# EAGLE design femto-beacon-esp32pico-d4-coin (EAGLE 9.3.0)

## Sheet 1 of 2
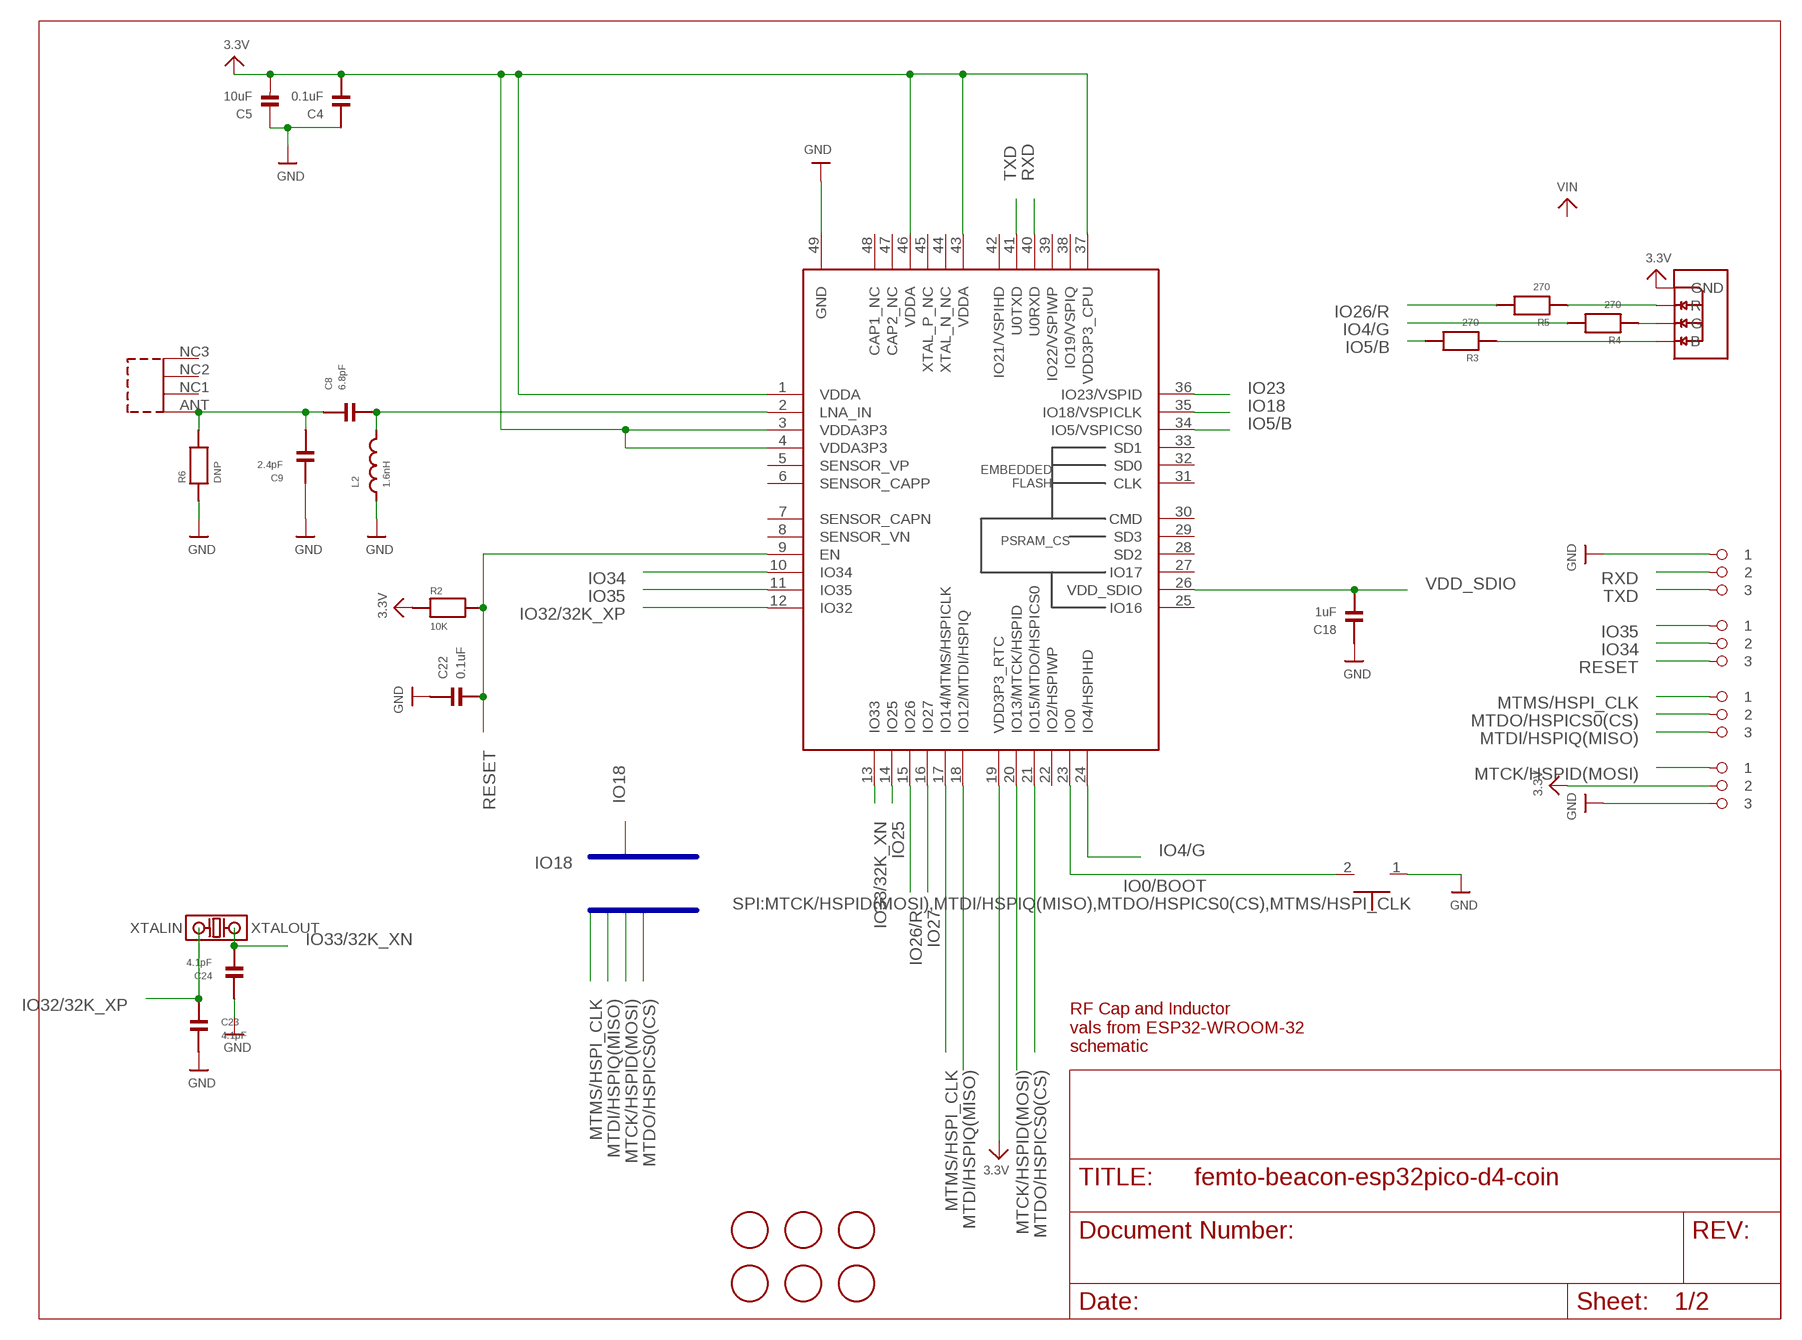
[diagram p0: schematic, sheet 1]

### Parts
ANT1  0479480001  [0479480001]
BOOT1  TACTILE_SWITCH_NO_GND_NO_BOSS  [SIDE_ACT_NO_GND_NO_BOSS]
C4  0.1uF  CAPACITOR_0201  [PART]
C5  10uF  CAP_CERAMIC_0603MP  [_0603MP]
C8  6.8pF  CAPACITOR_0201  [PART]
C9  2.4pF  CAPACITOR_0201  [PART]
C18  1uF  CAPACITOR_0201  [PART]
C22  0.1uF  CAPACITOR_0201  [PART]
C23  4.1pF  CAPACITOR_0201  [PART]
C24  4.1pF  CAPACITOR_0201  [PART]
FID1  FIDUCIAL  [FIDUCIAL_1MM]
FID2  FIDUCIAL  [FIDUCIAL_1MM]
FID3  FIDUCIAL  [FIDUCIAL_1MM]
FID4  FIDUCIAL  [FIDUCIAL_1MM]
FID5  FIDUCIAL  [FIDUCIAL_1MM]
FID6  FIDUCIAL  [FIDUCIAL_1MM]
IC1  ESP32-PICO-D4  [ESP32-QFN48_7X7]
L2  1.6nH  INDUCTOR_FIXED_0201  [PART]
PIN_EN  1X3_ROUND  [1X3_ROUND]
PIN_GPIO_A  1X3_ROUND  [1X3_ROUND]
PIN_GPIO_B  1X3_ROUND  [1X3_ROUND]
PIN_UART  1X3_ROUND  [1X3_ROUND]
R2  10K  RESISTOR_0201  [PART]
R3  270  RESISTOR_0201  [PART]
R4  270  RESISTOR_0201  [PART]
R5  270  RESISTOR_0201  [PART]
R6  DNP  RESISTOR_0201  [PART]
RGB1  LRTB_R48G  [LRTB_R48G]
XTAL2  ABS06-107-32.768KHZ-T  [ABS06-107-32.768KHZ-T]

### Nets
3.3V: C4.2 C5.2 IC1.1(VDDA) IC1.3(VDDA3P3) IC1.4(VDDA3P3) IC1.19(VDD3P3_RTC) IC1.37(VDD3P3_CPU) IC1.43(VDDA) IC1.46(VDDA) PIN_GPIO_A.P$2 R2.1 RGB1.1(GND) ; also sheet 2
ANT: C8.2 IC1.2(LNA_IN) L2.2
B_: R3.1 RGB1.4(B)
G_: R4.1 RGB1.3(G)
GND: BOOT1.1 C4.1 C5.1 C9.1 C18.1 C22.1 C23.1 C24.2 IC1.49(GND) L2.1 PIN_GPIO_A.P$3 PIN_UART.P$1 R6.1 ; also sheet 2
IO0/BOOT: BOOT1.2 IC1.23(IO0)
IO4/G: IC1.24(IO4/HSPIHD) R4.2
IO5/B: IC1.34(IO5/VSPICS0) R3.2
IO18: IC1.35(IO18/VSPICLK)
IO23: IC1.36(IO23/VSPID)
IO25: IC1.14(IO25)
IO26/R: IC1.15(IO26) R5.2
IO27: IC1.16(IO27)
IO32/32K_XP: C23.2 IC1.12(IO32) XTAL2.1(XTALIN)
IO33/32K_XN: C24.1 IC1.13(IO33) XTAL2.2(XTALOUT)
IO34: IC1.10(IO34) PIN_EN.P$2
IO35: IC1.11(IO35) PIN_EN.P$1
MTCK/HSPID(MOSI): IC1.20(IO13/MTCK/HSPID) PIN_GPIO_A.P$1
MTDI/HSPIQ(MISO): IC1.18(IO12/MTDI/HSPIQ) PIN_GPIO_B.P$3
MTDO/HSPICS0(CS): IC1.21(IO15/MTDO/HSPICS0) PIN_GPIO_B.P$2
MTMS/HSPI_CLK: IC1.17(IO14/MTMS/HSPICLK) PIN_GPIO_B.P$1
N$6: ANT1.ANT C8.1 C9.2 R6.2
R_: R5.1 RGB1.2(R)
RESET: C22.2 IC1.9(EN) PIN_EN.P$3 R2.2
RXD: IC1.40(U0RXD) PIN_UART.P$2
TXD: IC1.41(U0TXD) PIN_UART.P$3
VDD_SDIO: C18.2 IC1.26(VDD_SDIO)
Unconnected: ANT1.NC1 ANT1.NC2 ANT1.NC3 IC1.5(SENSOR_VP) IC1.6(SENSOR_CAPP) IC1.7(SENSOR_CAPN) IC1.8(SENSOR_VN) IC1.22(IO2/HSPIWP) IC1.25(IO16) IC1.27(IO17) IC1.28(SD2) IC1.29(SD3) IC1.30(CMD) IC1.31(CLK) IC1.32(SD0) IC1.33(SD1) IC1.38(IO19/VSPIQ) IC1.39(IO22/VSPIWP) IC1.42(IO21/VSPIHD) IC1.44(XTAL_N_NC) IC1.45(XTAL_P_NC) IC1.47(CAP2_NC) IC1.48(CAP1_NC)

### Buses
SPI:MTCK/HSPID(MOSI),MTDI/HSPIQ(MISO),MTDO/HSPICS0(CS),MTMS/HSPI_CLK
IO18

### Notes on the sheet
- RF Cap and Inductor
  vals from ESP32-WROOM-32
  schematic

## Sheet 2 of 2
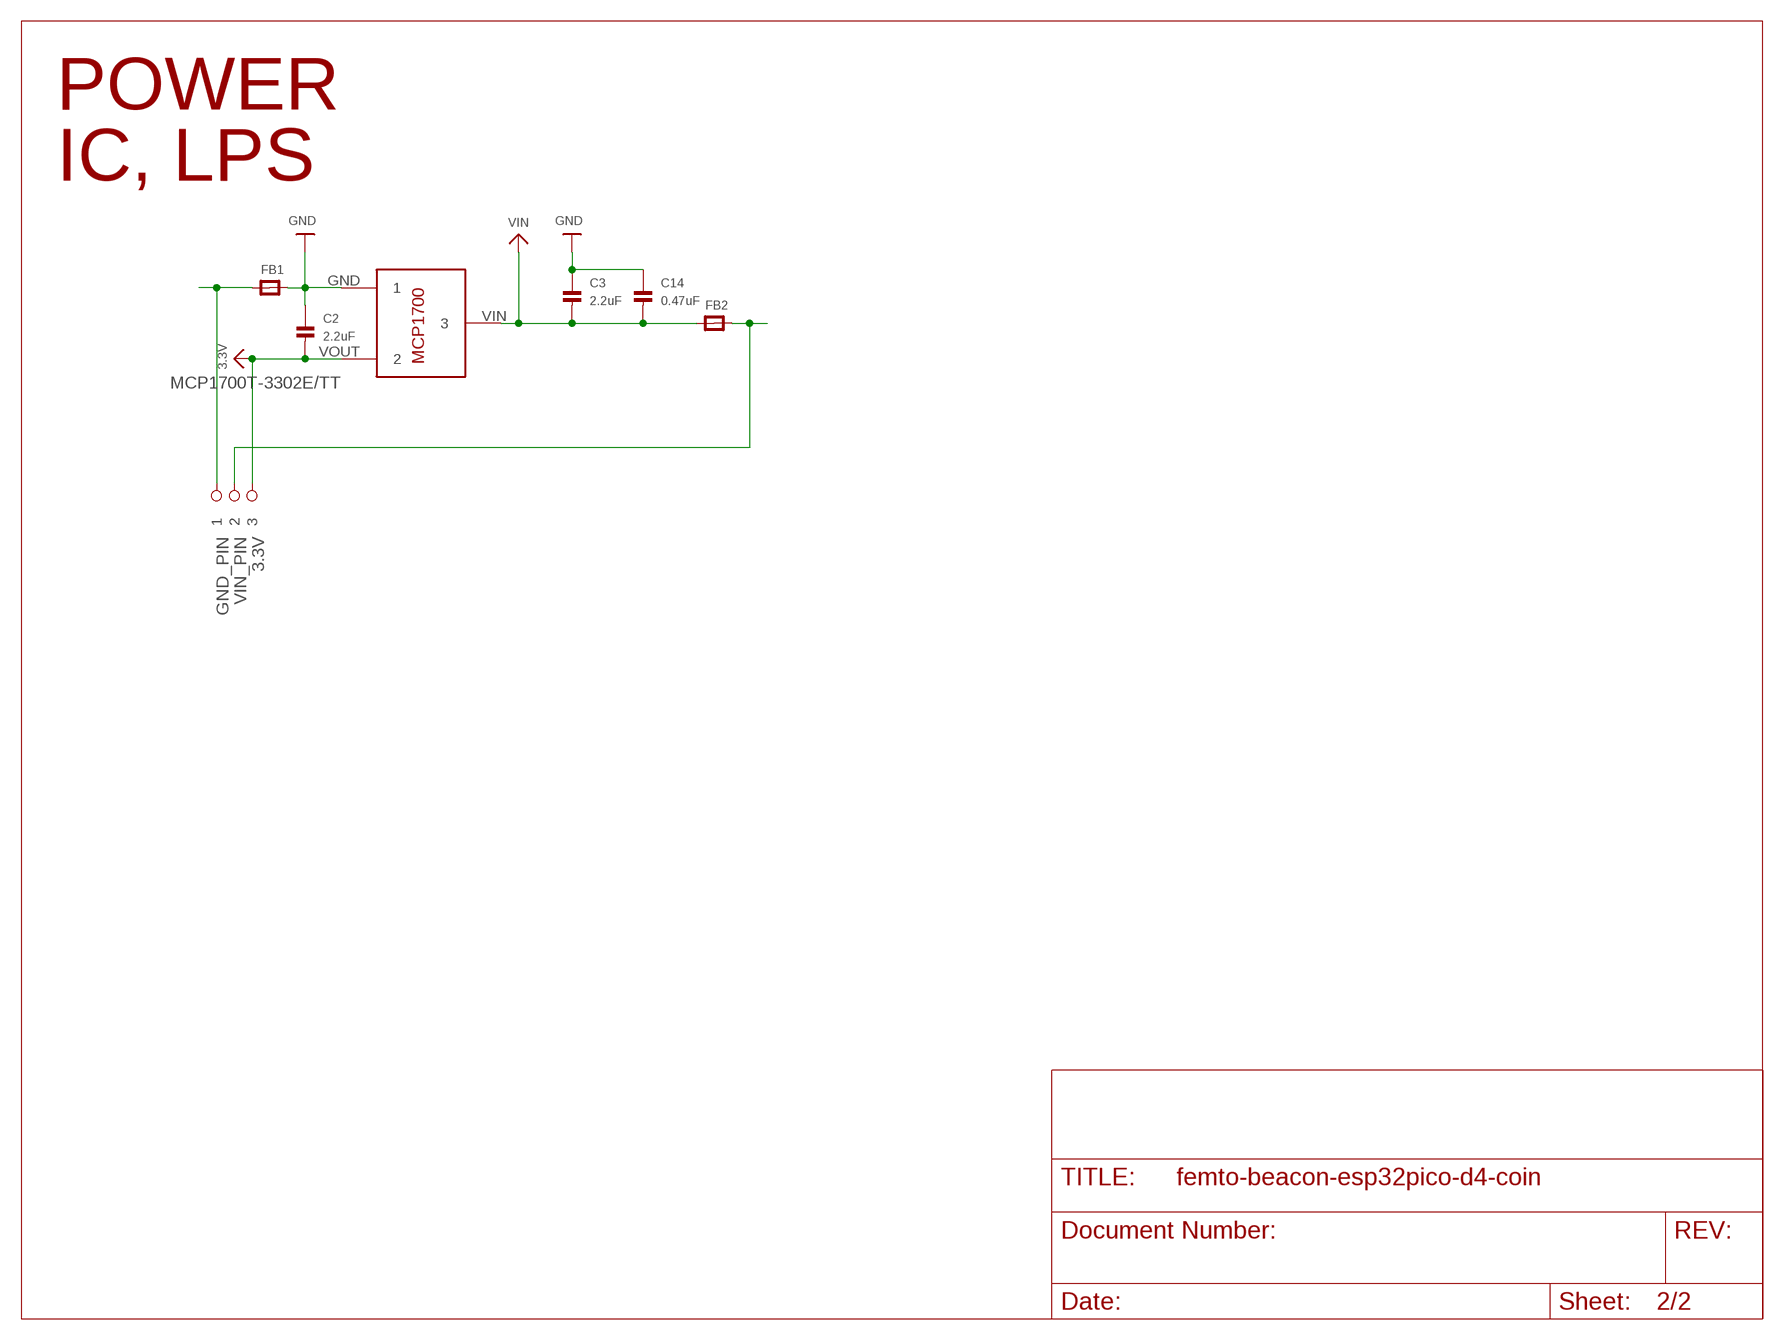
[diagram p1: schematic, sheet 2]

### Parts
C2  2.2uF  CAP_CERAMIC_0402MP  [_0402MP]
C3  2.2uF  CAP_CERAMIC_0402MP  [_0402MP]
C14  0.47uF  CAP_CERAMIC_0402MP  [_0402MP]
FB1  FERRITE_0603MP  [_0603MP]
FB2  FERRITE_0603MP  [_0603MP]
LDO1  MCP1700T-3302E/TT  [MCP1700T-3302E/TT]
PIN_PWR  1X3_ROUND  [1X3_ROUND]

### Nets
3.3V: C2.2 LDO1.VOUT PIN_PWR.P$3 ; also sheet 1
GND: C2.1 C3.1 C14.1 FB1.2 LDO1.GND ; also sheet 1
GND_PIN: FB1.1 PIN_PWR.P$1
VIN: C3.2 C14.2 FB2.1 LDO1.VIN
VIN_PIN: FB2.2 PIN_PWR.P$2

### Notes on the sheet
- POWER
- IC, LPS

## Library data of the parts
ANT1 = molex-antenna-2.4GHz:0479480001: Molex 2.4GHz SMD tower antenna.; MPN: 0479480001
BOOT1 = omron_tactile_switch:TACTILE_SWITCH_NO_GND_NO_BOSS: Omron tactile switch; MPN: B3U-3000P
C2 C3 = microbuilder:CAP_CERAMIC: Ceramic Capacitors 0402 - 0402 Surface Mount Capacitors 16pF 50V 5% [Digikey: 445-4899-2-ND] 18pF 50V 5% [Digikey: 490-1281-2-ND] 22pF 50V 5% [Digikey: 490-1283-2-ND] 68pF 50V 5% [Digikey: 490-1289-2-ND] 0.1uF 10V 10% [Digikey: 490-1318-2-ND] 1.0uF 6.3V 10% [Digikey: 490-1320-2-ND] 0603 - 0603 Surface Mount Capacitors 16 pF 50V 5% [Digikey: 445-5051-2-ND] 22 pF 50V [Digikey: PCC220ACVTR-ND] 33 pF 50V 5% [Digikey: 490-1415-1-ND] 56pF 50V 5% [Digikey: 490-1421-1-ND] 220pF 50V 5% [Digikey: 445-1285-1-ND] 680 pF 50V 2200 pF 50V 5% C0G [Digikey: 445-1297-1-ND] 5600 pF 100V 5% X7R [Digikey: 478-3711-1-ND] 0.1 µF 25V 10% [Digikey: PCC2277TR-ND] 0.22 µF 16V 10% X7R [Digikey: 445-1318-1-ND] 1.0 µF 25V 10% [Digikey: 445-5146-2-ND] 0603 - RF Specific 3pF 250V +/-0.1pF RF [Digikey: 712-1347-1-ND] 18 pF 250V 5% [Digikey: 478-3505-1-ND or 712-1322-1-ND] 56 pF 250V 5% C0G RF [Digikey: 490-4867-1-ND] 68 pF 250V RF [Digikey: 490-4868-1-ND] 0805 - 0805 Surface Mount Capacitors 220 pF 250V 2% RF Ceramic Capacitor [Digikey: 712-1398-1-ND] 1000 pF 50V 2% NP0 Ceramic Capacitor [Digikey: 478-3760-1-ND] 0.1 µF 25V 10% Ceramic Capacitor [Digikey: PCC1828TR-ND] 1.0 µF 16V 10% Ceramic Capacitor[Digikey: 490-1691-2-ND] 10.0 µF 10V 10% Ceramic Capacitor[Digikey: 709-1228-1-ND] 10.0 uF 16V 10% Ceramic Capacitor [Digikey: 478-5165-2-ND] 47 uF 6.3V 20% Ceramic Capacitor [Digikey: 587-1779-1-ND or 399-5506-1-ND] 1206 - 1206 Surface Mount Capacitors 47uF 10V 20% Ceramic Capacitor [Digikey: 490-5528-1-ND or 399-5508-1-ND or 445-6010-1-ND] 100uF 6.3V -20%, +80% Y5V Ceramic Capacitor (Digikey: 490-4512-1-ND, Mouser: 81-GRM31CF50J107ZE1L); MPN: C1005X5R0J225K050BC
C4 C22 = parts_0201:CAPACITOR_0201; MPN: GRM033C80J104KE84D
C5 = microbuilder:CAP_CERAMIC: Ceramic Capacitors 0402 - 0402 Surface Mount Capacitors 16pF 50V 5% [Digikey: 445-4899-2-ND] 18pF 50V 5% [Digikey: 490-1281-2-ND] 22pF 50V 5% [Digikey: 490-1283-2-ND] 68pF 50V 5% [Digikey: 490-1289-2-ND] 0.1uF 10V 10% [Digikey: 490-1318-2-ND] 1.0uF 6.3V 10% [Digikey: 490-1320-2-ND] 0603 - 0603 Surface Mount Capacitors 16 pF 50V 5% [Digikey: 445-5051-2-ND] 22 pF 50V [Digikey: PCC220ACVTR-ND] 33 pF 50V 5% [Digikey: 490-1415-1-ND] 56pF 50V 5% [Digikey: 490-1421-1-ND] 220pF 50V 5% [Digikey: 445-1285-1-ND] 680 pF 50V 2200 pF 50V 5% C0G [Digikey: 445-1297-1-ND] 5600 pF 100V 5% X7R [Digikey: 478-3711-1-ND] 0.1 µF 25V 10% [Digikey: PCC2277TR-ND] 0.22 µF 16V 10% X7R [Digikey: 445-1318-1-ND] 1.0 µF 25V 10% [Digikey: 445-5146-2-ND] 0603 - RF Specific 3pF 250V +/-0.1pF RF [Digikey: 712-1347-1-ND] 18 pF 250V 5% [Digikey: 478-3505-1-ND or 712-1322-1-ND] 56 pF 250V 5% C0G RF [Digikey: 490-4867-1-ND] 68 pF 250V RF [Digikey: 490-4868-1-ND] 0805 - 0805 Surface Mount Capacitors 220 pF 250V 2% RF Ceramic Capacitor [Digikey: 712-1398-1-ND] 1000 pF 50V 2% NP0 Ceramic Capacitor [Digikey: 478-3760-1-ND] 0.1 µF 25V 10% Ceramic Capacitor [Digikey: PCC1828TR-ND] 1.0 µF 16V 10% Ceramic Capacitor[Digikey: 490-1691-2-ND] 10.0 µF 10V 10% Ceramic Capacitor[Digikey: 709-1228-1-ND] 10.0 uF 16V 10% Ceramic Capacitor [Digikey: 478-5165-2-ND] 47 uF 6.3V 20% Ceramic Capacitor [Digikey: 587-1779-1-ND or 399-5506-1-ND] 1206 - 1206 Surface Mount Capacitors 47uF 10V 20% Ceramic Capacitor [Digikey: 490-5528-1-ND or 399-5508-1-ND or 445-6010-1-ND] 100uF 6.3V -20%, +80% Y5V Ceramic Capacitor (Digikey: 490-4512-1-ND, Mouser: 81-GRM31CF50J107ZE1L); MPN: GRM188R61C106KAALD
C8 = parts_0201:CAPACITOR_0201; MPN: GRM0335C2A6R8DA01D
C9 = parts_0201:CAPACITOR_0201; MPN: GRM0335C1H2R4CA01D
C14 = microbuilder:CAP_CERAMIC: Ceramic Capacitors 0402 - 0402 Surface Mount Capacitors 16pF 50V 5% [Digikey: 445-4899-2-ND] 18pF 50V 5% [Digikey: 490-1281-2-ND] 22pF 50V 5% [Digikey: 490-1283-2-ND] 68pF 50V 5% [Digikey: 490-1289-2-ND] 0.1uF 10V 10% [Digikey: 490-1318-2-ND] 1.0uF 6.3V 10% [Digikey: 490-1320-2-ND] 0603 - 0603 Surface Mount Capacitors 16 pF 50V 5% [Digikey: 445-5051-2-ND] 22 pF 50V [Digikey: PCC220ACVTR-ND] 33 pF 50V 5% [Digikey: 490-1415-1-ND] 56pF 50V 5% [Digikey: 490-1421-1-ND] 220pF 50V 5% [Digikey: 445-1285-1-ND] 680 pF 50V 2200 pF 50V 5% C0G [Digikey: 445-1297-1-ND] 5600 pF 100V 5% X7R [Digikey: 478-3711-1-ND] 0.1 µF 25V 10% [Digikey: PCC2277TR-ND] 0.22 µF 16V 10% X7R [Digikey: 445-1318-1-ND] 1.0 µF 25V 10% [Digikey: 445-5146-2-ND] 0603 - RF Specific 3pF 250V +/-0.1pF RF [Digikey: 712-1347-1-ND] 18 pF 250V 5% [Digikey: 478-3505-1-ND or 712-1322-1-ND] 56 pF 250V 5% C0G RF [Digikey: 490-4867-1-ND] 68 pF 250V RF [Digikey: 490-4868-1-ND] 0805 - 0805 Surface Mount Capacitors 220 pF 250V 2% RF Ceramic Capacitor [Digikey: 712-1398-1-ND] 1000 pF 50V 2% NP0 Ceramic Capacitor [Digikey: 478-3760-1-ND] 0.1 µF 25V 10% Ceramic Capacitor [Digikey: PCC1828TR-ND] 1.0 µF 16V 10% Ceramic Capacitor[Digikey: 490-1691-2-ND] 10.0 µF 10V 10% Ceramic Capacitor[Digikey: 709-1228-1-ND] 10.0 uF 16V 10% Ceramic Capacitor [Digikey: 478-5165-2-ND] 47 uF 6.3V 20% Ceramic Capacitor [Digikey: 587-1779-1-ND or 399-5506-1-ND] 1206 - 1206 Surface Mount Capacitors 47uF 10V 20% Ceramic Capacitor [Digikey: 490-5528-1-ND or 399-5508-1-ND or 445-6010-1-ND] 100uF 6.3V -20%, +80% Y5V Ceramic Capacitor (Digikey: 490-4512-1-ND, Mouser: 81-GRM31CF50J107ZE1L); MPN: GRM155R60J474KE19D
C18 = parts_0201:CAPACITOR_0201; MPN: CL03A105KQ3CSNH
C23 C24 = parts_0201:CAPACITOR_0201; MPN: GRM0335C1H4R1BA01D
FB1 FB2 = microbuilder:FERRITE: Ferrite Bead 0603 MMZ1608B121C - 120 Ohm @ 100MHz, 600mA, 0.15 Ohm DC Resistance - Digikey: 445-2164-1-ND BK1608HW121-T - 120 Ohm, 600mA Ferrite Chip - Digikey: 587-1876-2-ND 0805 HZ0805B272R-10 - 2.7K Ohm @ 100MHz, 200mA, 0.8 Ohm DC Resistance - Digikey: 240-2504-1-ND (see also Murata BLM21BD272SN1L) MMZ2012Y152B - 1.5K Ohm @ 100MHz, 500mA, 0.4 Ohm DC Resistance - Digikey: 445-1560-1-ND - Mainly for high frequency (80-400MHz) MMZ2012R102A - 1K Ohm @ 100MHz, 500mA, 0.3 Ohm DC Resistance - Digikey: 445-1555-2-ND - More general purpose (10-200MHz); MPN: BLM18RK102SN1D
FID1-FID6 = adafruit:FIDUCIAL: For use by pick and place machines to calibrate the vision/machine, 1mm By microbuilder.eu
IC1 = esp32-wroom-32:ESP32-PICO-D4; MPN: ESP32-PICO-D4
L2 = parts_0201:INDUCTOR_FIXED_0201; MPN: LQP03HQ1N6B02D
LDO1 = MCP1700T-3302E_TT:MCP1700T-3302E/TT: Microchip LDO "MCP1700" in a 3-Pin SOT-23 package. ID: MCP1700T-3302E/TT; MPN: MCP1700T-3302E/TT
PIN_EN PIN_GPIO_A PIN_GPIO_B PIN_PWR PIN_UART = pins_1.27mm_pitch:1X3_ROUND
R2 = parts_0201:RESISTOR_0201; MPN: RC0201JR-0710KL
R3-R5 = parts_0201:RESISTOR_0201; MPN: RC0201FR-07270RL
R6 = parts_0201:RESISTOR_0201
RGB1 = osram_opto_LED:LRTB_R48G: OSRAM RGB LED; MPN: LRTB R48G
XTAL2 = crystals:ABS06-107-32.768KHZ-T: ABS06-107-32.768kHz-T Crystal Oscillator; MPN: ABS06-107-32.768kHz-T

## Board
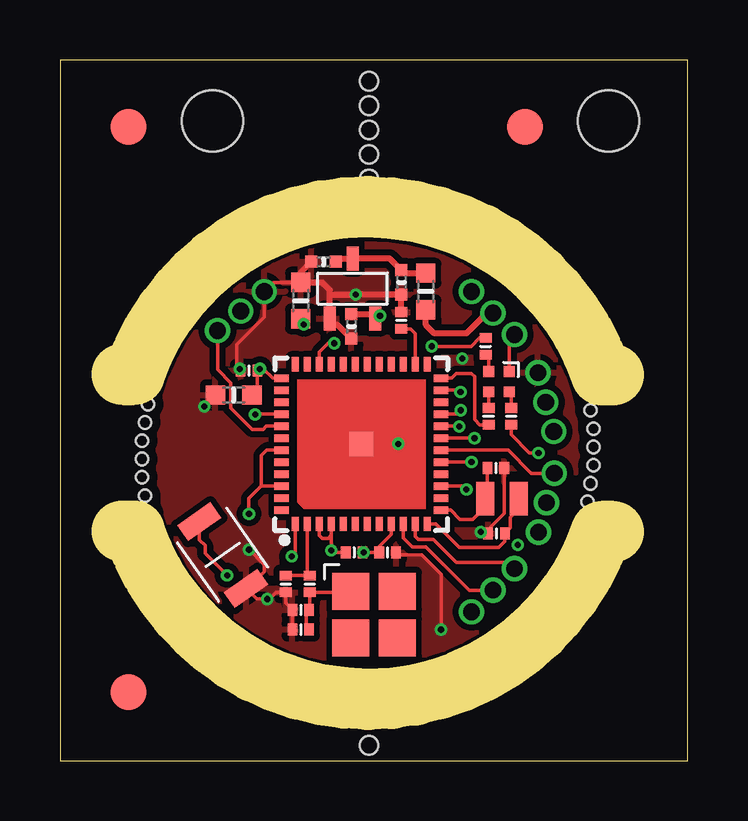
[diagram p2: board, top side]
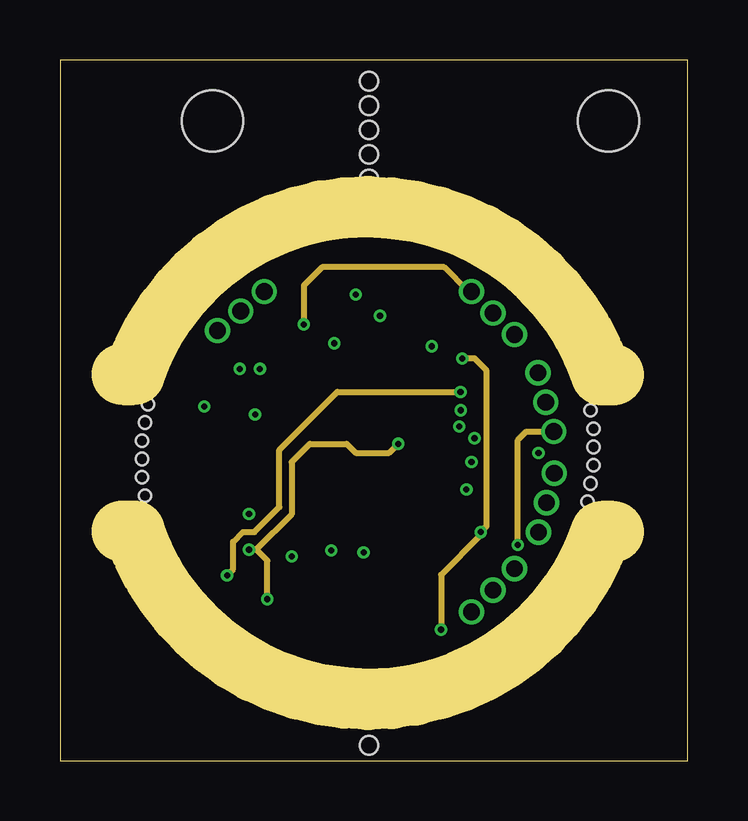
[diagram p3: board, inner layer Route2]
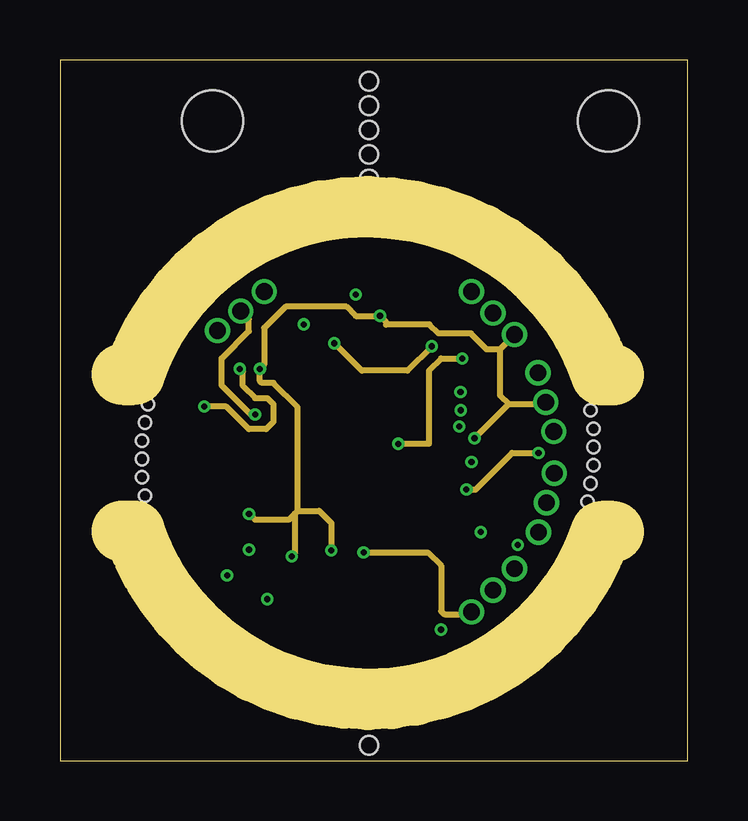
[diagram p4: board, inner layer Route15]
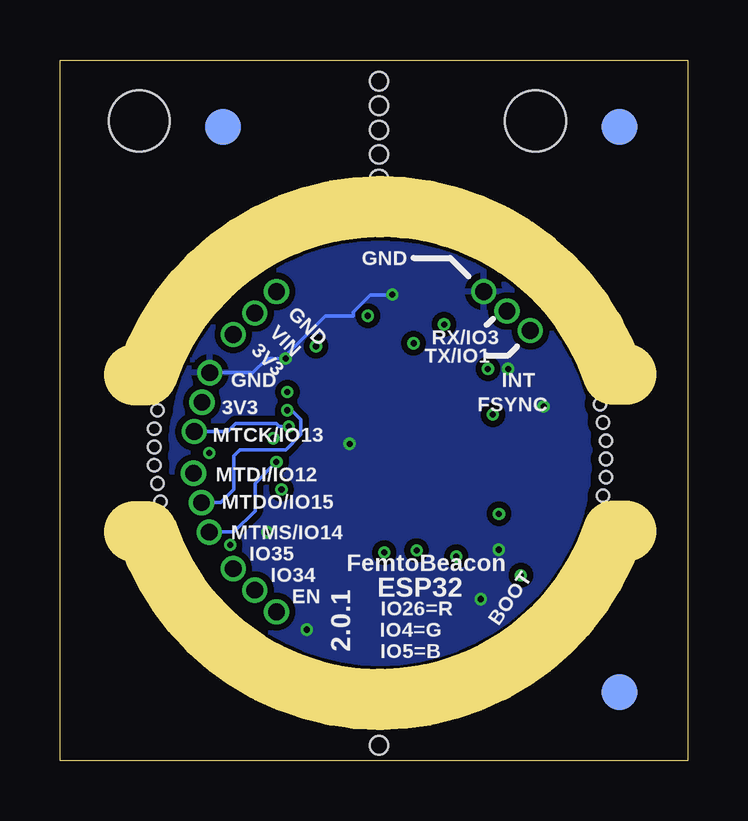
[diagram p5: board, bottom side, seen from below]

Size 26.16 x 29.21 mm. Coordinates in mm from the lower left corner, seen from the top.
Outline: 0,0 26.16,0 26.16,29.21 0,29.21 0,0
Copper layers (1*2*15*16): Top 0.035559375mm / dielectric 0.17018125mm / Route2 0.01778125mm / dielectric 47mil / Route15 0.01778125mm / dielectric 0.17018125mm / Bottom 0.035559375mm
Design rules "oshpark-4layer *": minimum track width 5mil, minimum drill 10mil, track to track 6mil, track to pad 6mil, pad to pad 6mil, via to via 6mil, smd to smd 5mil, copper to edge 15mil, drill to drill 6mil, minimum pad ring 4mil, minimum via ring 4mil, stop-mask expansion 2.5mil, vias tented up to drill 10mil, thermal gap 10mil
Holes 0.51 mm at 3.41,12.57 3.67,10.29 3.41,11.81 3.41,13.34 3.54,11.05 3.67,14.86 3.54,14.1 22.23,13.08 21.98,15.36 22.23,13.84 22.23,12.31 22.11,14.6 21.98,10.79 22.11,11.55
Holes 0.76 mm at 12.87,0.64 12.87,24.26 12.87,25.27 12.87,26.29 12.87,27.3 12.87,28.32
Holes 2.54 mm at 22.86,26.67 6.35,26.67
Milling: 8 lines

### Footprints (pad centres in the part's own frame; a part is rotated, then mirrored left to right if it is on the bottom)
0479480001 = smd 1.54 x 1.54: ANT -0.963,0.963; NC1 0.978,0.963; NC2 0.978,-0.978; NC3 -0.963,-0.978
SIDE_ACT_NO_GND_NO_BOSS = smd 0.8 x 1.7: 1 -1.7,0; 2 1.7,0
_0402MP = smd 0.5 x 0.5: 1 -0.508,0; 2 0.508,0
PART = smd 0.4 x 0.5: 1 -0.35,0; 2 0.35,0
_0603MP = smd 0.8 x 0.8: 1 -0.762,0; 2 0.762,0
FIDUCIAL_1MM = smd 1.5 x 1.5: 1 0,0
ESP32-QFN48_7X7 = smd 0.6 x 0.3: 1 -3.325,2.75; 2 -3.325,2.25; 3 -3.325,1.75; 4 -3.325,1.25; 5 -3.325,0.75; 6 -3.325,0.25; 7 -3.325,-0.25; 8 -3.325,-0.75; 9 -3.325,-1.25; 10 -3.325,-1.75; 11 -3.325,-2.25; 12 -3.325,-2.75; 25 3.325,-2.75; 26 3.325,-2.25; 27 3.325,-1.75; 28 3.325,-1.25; 29 3.325,-0.75; 30 3.325,-0.25; 31 3.325,0.25; 32 3.325,0.75; 33 3.325,1.25; 34 3.325,1.75; 35 3.325,2.25; 36 3.325,2.75 | smd 0.3 x 0.6: 13 -2.75,-3.325; 14 -2.25,-3.325; 15 -1.75,-3.325; 16 -1.25,-3.325; 17 -0.75,-3.325; 18 -0.25,-3.325; 19 0.25,-3.325; 20 0.75,-3.325; 21 1.25,-3.325; 22 1.75,-3.325; 23 2.25,-3.325; 24 2.75,-3.325; 37 2.75,3.325; 38 2.25,3.325; 39 1.75,3.325; 40 1.25,3.325; 41 0.75,3.325; 42 0.25,3.325; 43 -0.25,3.325; 44 -0.75,3.325; 45 -1.25,3.325; 46 -1.75,3.325; 47 -2.25,3.325; 48 -2.75,3.325 | smd 1 x 1: 49 0,0
MCP1700T-3302E/TT = smd 0.5 x 1: GND -0.95,-1.25; VIN 0,1.25; VOUT 0.95,-1.25
1X3_ROUND = drill 0.7 pad 1: P$1 0,0; P$2 0,-1.27; P$3 0,-2.54
LRTB_R48G = smd 0.45 x 0.45: 1 0.425,0.425; 2 0.425,-0.425; 3 -0.425,-0.425; 4 -0.425,0.425
ABS06-107-32.768KHZ-T = smd 0.75 x 1.4: 1 -0.7,0; 2 0.7,0

### Placement (x,y rotation side)
ANT1  13.08,6.1 0 top
BOOT1  6.78,8.57 125 top
C2  12.14,18.1 90 top
C3  10.99,20.8 0 top
C4  7.87,16.26 0 top
C5  7.24,15.24 0 top
C8  10.41,7.37 90 top
C9  10.03,6.29 0 top
C14  14.22,19.94 90 top
C18  14.22,18.35 270 top
C22  13.65,8.67 180 top
C23  18.19,9.47 0 top
C24  18.16,12.19 0 top
FB1  10.03,19.18 90 top
FB2  15.24,19.56 270 top
FID1  2.86,2.86 0 top
FID2  2.86,26.42 0 top
FID3  19.37,26.42 0 top
FID4  2.86,2.86 0 bottom
FID5  2.86,26.42 0 bottom
FID6  19.37,26.42 0 bottom
IC1  12.56,13.19 90 top
L2  9.4,7.37 90 top
LDO1  12.19,19.68 0 top
PIN_EN  18.94,8 315 top
PIN_GPIO_A  20.57,13.72 195 top
PIN_GPIO_B  19.94,9.53 165 top
PIN_PWR  17.14,19.56 45 top
PIN_UART  8.51,19.56 310 top
R2  12.26,8.67 0 top
R3  17.73,17.27 90 top
R4  17.86,14.35 270 top
R5  18.8,14.35 270 top
R6  10.03,5.46 0 top
RGB1  18.29,15.8 0 top
XTAL2  18.41,10.92 180 top

### Tracks (layer width: path | path; a pad name or v marks a point on that pad's centre or on a via)
3.3V  (via drill 0.25 pad 0.51)
  Top 0.152: IC1.3 10.81,9.39 10.92,9.27 11.18,9.27 11.3,9.4 | IC1.4 11.31,9.4 11.3,9.4 | IC1.1 9.81,8.66 v9.65,8.51 | 11.3,9.4 v11.3,8.76 11.39,8.67 R2.1 | IC1.46 8.39,11.44 | 8.39,11.44 7.87,10.92 v7.87,10.29 | IC1.43 8.62,12.94 8.39,12.71 8.39,11.44 | IC1.37 8.86,15.94 8.46,16.33 v8.33,16.33 8.3,16.33 C4.2 8.22,15.46 C5.2 | PIN_PWR.P$3 18.71,17.53 RGB1.1 | IC1.19 v17.27,13.44
  Top 0.254: C2.2 12.97,18.61 LDO1.VOUT 13.23,18.43 v13.34,18.54
  Route15 0.254: 9.78,10.29 9.78,8.64 v9.65,8.51 | 9.78,10.29 9.53,10.03 8.13,10.03 v7.87,10.29 | 9.78,10.29 9.91,10.41 | 9.91,10.41 10.79,10.41 11.3,9.91 v11.3,8.76 | 9.91,10.41 9.91,14.73 8.89,15.75 8.41,15.75 8.33,15.82 v8.33,16.33 8.51,16.51 8.51,18.03 9.4,18.92 11.94,18.92 12.32,18.54 v13.34,18.54 13.59,18.29 13.59,18.16 13.61,18.19 15.39,18.19 15.77,17.8 17.12,17.8 17.78,17.14 18.32,17.14 | PIN_PWR.P$3 18.32,17.14 | v17.27,13.44 18.69,14.86 | PIN_GPIO_A.P$2 20.16,14.86 18.69,14.86 | 18.32,17.14 18.32,15.22 18.69,14.86
ANT
  Top 0.152: IC1.2 10.31,7.82 C8.2 L2.2
B_
  Top 0.152: RGB1.4 17.86,16.79 R3.1
G_
  Top 0.152: R4.1 RGB1.3
GND  (via drill 0.25 pad 0.51)
  Top 0.152: 13.99,13.32 12.68,13.32 IC1.49 | C5.1 6.01,14.78 v6.01,14.76 | C4.1 7.5,16.28 v7.49,16.33 7.37,16.46 7.37,17.35 8.51,18.49 PIN_UART.P$1 8.89,19.94 FB1.2 | BOOT1.1 7.78,7.15 | 7.78,7.15 8.2,6.73 v8.64,6.73 8.73,6.73 9.02,7.02 L2.1 9.4,6.57 C9.1 R6.1 | v7.88,8.79 8.51,8.16 8.51,7.87 7.78,7.15 | 11.3,18.37 LDO1.GND | C24.2 18.51,10.31 17.95,9.75 17.95,9.67 17.84,9.55 C23.1 17.78,9.53 v17.53,9.53 | v15.88,5.46 15.88,7.77 15.07,8.57 14.1,8.57 C22.1
  Top 0.254: LDO1.GND 11.24,19.43 | 11.24,19.43 11.24,19.62 10.92,19.94 FB1.2 10.03,20.36 C3.1 | C18.1 C14.1 v12.32,19.43 11.24,19.43 | C2.1 11.57,18.16 11.3,18.16 11.3,18.37 | v14.1,13.21 13.99,13.32
  Route2 0.254: 8.18,8.79 9.65,10.27 9.65,12.45 10.41,13.21 11.94,13.21 12.32,12.83 13.72,12.83 v14.1,13.21 | 8.18,8.79 v7.88,8.79 | v15.88,5.46 15.88,7.75 17.53,9.4 v17.53,9.53 17.78,9.78 17.78,16.26 17.27,16.76 v16.76,16.76 | v8.64,6.73 8.64,8.34 8.18,8.79
  Route15 0.254: v7.49,16.33 7.62,16.2 7.62,15.62 8.13,15.11 8.64,15.11 8.89,14.86 8.89,14.12 8.59,13.82 7.87,13.82 6.93,14.76 v6.01,14.76 | v16.76,16.76 15.88,16.76 15.37,16.26 15.37,13.21 v14.1,13.21
  Bottom 0.152: v7.87,8.79 v7.88,8.79 | PIN_GPIO_A.P$3 18.12,16.17 17.53,16.76 v16.76,16.76 16.76,16.89 15.11,18.54 13.95,18.54 13.95,18.69 13.23,19.41 12.37,19.41 12.33,19.45 v12.32,19.43
  pour Bottom (isolate 0.254): 4.06,12.81 arc-90 12.81,21.56 arc-90 21.56,12.81 arc-90 12.81,4.06 arc-90
  pour Top (isolate 0.254): 4.06,12.81 arc-90 12.81,21.56 arc-90 21.56,12.81 arc-90 12.81,4.06 arc-90
GND_PIN  (via drill 0.25 pad 0.51)
  Top 0.254: v10.16,18.19 10.03,18.31 FB1.1
  Route2 0.254: PIN_PWR.P$1 17.02,19.56 16,20.57 10.92,20.57 10.16,19.81 v10.16,18.19
IO0/BOOT  (via drill 0.25 pad 0.51)
  Top 0.152: IC1.23 16.61,15.44 v16.69,15.37 | BOOT1.2 5.8,9.21 6.05,8.96 6.05,8.63 v6.96,7.72
  Route2 0.254: v16.69,15.37 11.56,15.37 9.14,12.95 9.14,10.57 8.1,9.53 7.62,9.53 7.21,9.12 7.21,7.98 v6.96,7.72
IO4/G
  Top 0.152: IC1.24 16.32,15.94 16.51,16.13 17.14,16.13 17.27,16 17.27,14.22 17.5,14 R4.2
IO5/B  (via drill 0.25 pad 0.51)
  Top 0.152: IC1.34 10.81,17.03 11.18,17.4 v11.43,17.4 | v15.49,17.27 17.12,17.27 17.48,17.62 R3.2
  Route15 0.254: v11.43,17.4 12.57,16.26 14.48,16.26 v15.49,17.27
IO26/R  (via drill 0.25 pad 0.51)
  Top 0.152: IC1.15 16.8,11.44 v16.93,11.3 | v19.94,12.83 19.56,12.83 18.8,13.59 R5.2
  Route15 0.254: v16.93,11.3 17.32,11.3 18.84,12.83 v19.94,12.83
IO32/32K_XP
  Top 0.152: IC1.12 15.66,9.87 16.64,8.89 18.29,8.89 18.54,9.14 C23.2 18.77,9.7 18.77,10.13 19.11,10.48 XTAL2.1
IO33/32K_XN
  Top 0.152: C24.1 17.81,11.02 XTAL2.2 17.71,10.57 17.21,10.06 16.66,10.06 16.28,10.44 IC1.13
IO34
  Top 0.152: IC1.10 14.31,9.29 14.68,8.91 15.24,8.91 17.05,7.1 PIN_EN.P$2
IO35
  Top 0.152: IC1.11 14.81,9.35 14.94,9.22 15.54,9.22 16.51,8.26 18.69,8.26 PIN_EN.P$1
MTCK/HSPID(MOSI)  (via drill 0.25 pad 0.51)
  Top 0.152: IC1.20 16.62,13.94 v16.64,13.92
  Route2 0.254: v19.07,8.99 19.07,13.36 19.43,13.72 PIN_GPIO_A.P$1
  Bottom 0.152: v16.64,13.92 17.02,13.92 17.14,14.05 18.84,14.05 19.18,13.72 PIN_GPIO_A.P$1
MTDI/HSPIQ(MISO)
  Top 0.152: IC1.18 18.68,12.94 19.64,11.98 PIN_GPIO_B.P$3
MTDO/HSPICS0(CS)  (via drill 0.25 pad 0.51)
  Top 0.152: IC1.21 16.53,14.44 v16.69,14.61
  Bottom 0.152: v16.69,14.61 16.51,14.61 16.13,14.22 16.13,13.59 16.76,12.95 18.67,12.95 18.92,12.7 18.92,11.3 19.47,10.75 PIN_GPIO_B.P$2
MTMS/HSPI_CLK  (via drill 0.25 pad 0.51)
  Top 0.152: IC1.17 v17.14,12.44 v17.14,12.45
  Bottom 0.152: v17.14,12.45 18.03,11.56 18.03,10.41 18.92,9.53 PIN_GPIO_B.P$1
N$6
  Top 0.152: ANT1.ANT 12.08,7.02 C8.1 10.41,6.32 C9.2 10.26,6.16 10.26,5.59 R6.2
R_
  Top 0.152: R5.1 18.8,15.29 RGB1.2
RESET  (via drill 0.25 pad 0.51)
  Top 0.152: IC1.9 13.81,9.43 13.3,8.93 C22.2 v12.65,8.67 R2.2
  Route15 0.254: v12.65,8.67 15.33,8.67 15.88,8.13 15.88,6.22 16,6.1 17.04,6.1 PIN_EN.P$3
RXD  (via drill 0.25 pad 0.51)
  Top 0.152: IC1.40 8.14,14.44 v8.13,14.42
  Route15 0.254: v8.13,14.42 7.95,14.42 6.73,15.64 6.73,16.76 7.87,17.91 7.87,18.4 PIN_UART.P$2
TXD
  Top 0.152: IC1.41 8.6,13.94 8.47,13.81 8.01,13.81 7.11,14.71 7.11,15.75 6.56,16.3 PIN_UART.P$3
VDD_SDIO
  Top 0.152: IC1.26 14.81,17.8 14.61,18 C18.2
VIN
  Top 0.254: C3.2 11.63,20.93 LDO1.VIN 13.74,20.93 C14.2 14.35,20.32 FB2.1
VIN_PIN
  Top 0.254: PIN_PWR.P$2 17.79,18.66 16.93,17.8 15.6,17.8 15.24,18.16 FB2.2

### Text on the board
bPlace: GND | GND | RX/IO3 | VIN | TX/IO1 | 3V3 | INT | GND | FSYNC | 3V3 | MTCK/IO13 | MTDI/IO12 | MTDO/IO15 | MTMS/IO14 | IO35 | BOOT | FemtoBeacon | IO34 | ESP32 | EN | IO26=R | 2.0.1 | IO4=G | IO5=B